# Altium schematic sheet EnDat.SchDoc
size A; SheetNumber: 2; SheetTotal: 11
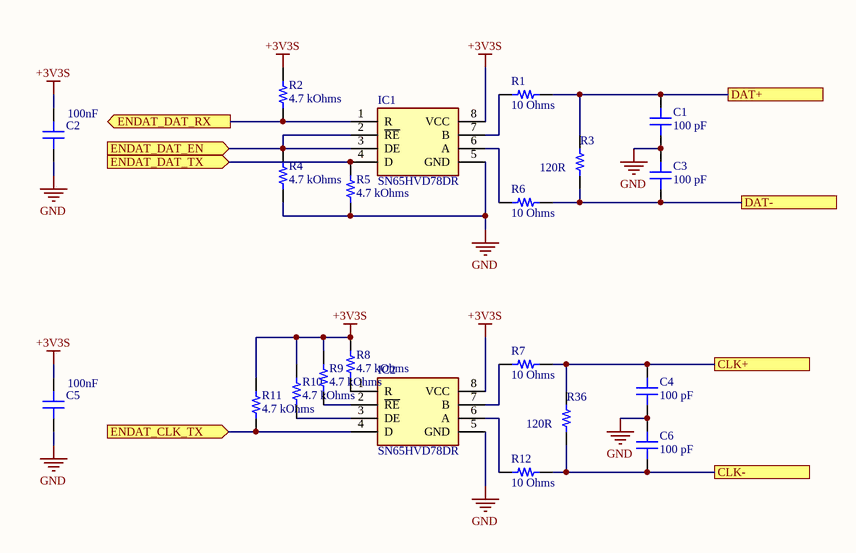
[diagram p0: EnDat.SchDoc]

## Parts
C1  100 pF  [CAP 0402_1005]
C2  100nF  [CAP 0402_1005]
C3  100 pF  [CAP 0402_1005]
C4  100 pF  [CAP 0402_1005]
C5  100nF  [CAP 0402_1005]
C6  100 pF  [CAP 0402_1005]
IC1  SN65HVD78DR  [SOIC127P600X175-8N]
IC2  SN65HVD78DR  [SOIC127P600X175-8N]
R1  10 Ohms  [RES 0402_1005]
R2  4.7 kOhms  [RES 0402_1005]
R3  120R  [RES 0603_1608]
R4  4.7 kOhms  [RES 0402_1005]
R5  4.7 kOhms  [RES 0402_1005]
R6  10 Ohms  [RES 0402_1005]
R7  10 Ohms  [RES 0402_1005]
R8  4.7 kOhms  [RES 0402_1005]
R9  4.7 kOhms  [RES 0402_1005]
R10  4.7 kOhms  [RES 0402_1005]
R11  4.7 kOhms  [RES 0402_1005]
R12  10 Ohms  [RES 0402_1005]
R36  120R  [RES 0603_1608]

## Ports
CLK+, CLK-, DAT+, DAT-, ENDAT_CLK_TX (in), ENDAT_DAT_EN (in), ENDAT_DAT_RX (out), ENDAT_DAT_TX (in)

## Nets
+3V3S: C2.2 C5.2 IC1.8(VCC) IC2.8(VCC) R2.2 R8.2 R9.2 R10.2 R11.2
GND: C1.1 C2.1 C3.2 C4.1 C5.1 C6.2 IC1.5(GND) IC2.5(GND) R4.1 R5.1
CLK+: C4.2 R7.2 R36.2 ; port CLK+
CLK-: C6.1 R12.2 R36.1 ; port CLK-
DAT+: C1.2 R1.2 R3.2 ; port DAT+
DAT-: C3.1 R3.1 R6.2 ; port DAT-
ENDAT_CLK_TX: IC2.4(D) R11.1 ; port ENDAT_CLK_TX
ENDAT_DAT_EN: IC1.2(~{RE}) IC1.3(DE) R4.2 ; port ENDAT_DAT_EN
ENDAT_DAT_RX: IC1.1(R) R2.1 ; port ENDAT_DAT_RX
ENDAT_DAT_TX: IC1.4(D) R5.2 ; port ENDAT_DAT_TX
NetIC1_6: IC1.6(A) R6.1
NetIC1_7: IC1.7(B) R1.1
NetIC2_1: IC2.1(R) R8.1
NetIC2_2: IC2.2(~{RE}) R9.1
NetIC2_3: IC2.3(DE) R10.1
NetIC2_6: IC2.6(A) R12.1
NetIC2_7: IC2.7(B) R7.1

## Library data of the parts
C1 C3 C4 C6 = 500X07N101MV4T: CAP CER 100PF 50V C0G/NP0 0402; manufacturer: Johanson Dielectrics Inc.; Temperature Coefficient: C0G, NP0; Tolerance: ±20%; Part Number: 500X07N101MV4T; Capacitance: 100 pF; Applications: Bypass, Decoupling; componentlink1description: Datasheet; componentlink1url: https://www.johansondielectrics.com/downloads/x2y-filter-and-decoupling-capacitors.pdf; componentlink2description: DigiKey Link; componentlink2url: https://www.digikey.com/en/products/detail/johanson-dielectrics-inc/500X07N101MV4T/2046917; Device Package: 0402 (1005 Metric); Features: Low ESL (X2Y); lastupdated: 2/9/2024 8:04:38 PM; Lifecycle Status: Active; Minimum Order: 1; Mounting Type: Surface Mount, MLCC; Operating Temperature: -55°C ~ 125°C; Package / Case: 0402 (1005 Metric); packaging: TapeAndReel; partid: 1767; Part Status: Active; price: 0.08; series: X2Y®; Size / Dimension: 0.045" L x 0.025" W (1.14mm x 0.64mm); Supplier 1: DigiKey; Supplier Part Number 1: 709-1214-1-ND; Thickness (Max): 0.020" (0.51mm); value: 100 pF; Voltage - Rated: 50V
C2 C5 = CL05A105KO5NNNC: CAP CER 1UF 16V X5R 0402; Part Number: C29266; manufacturer: Samsung Electro-Mechanics; Capacitance: 10uF; Tolerance: ±10%; value: 1 µF; Applications: General Purpose; componentlink1description: Datasheet; componentlink1url: http://www.samsungsem.com/kr/support/product-search/mlcc/CL05A105KO5NNNC.jsp; componentlink2description: DigiKey Link; componentlink2url: https://www.digikey.com/en/products/detail/samsung-electro-mechanics/CL05A105KO5NNNC/3886725; Device Package: 0402 (1005 Metric); lastupdated: 2/9/2024 8:04:35 PM; Lifecycle Status: Active; Minimum Order: 1; Mounting Type: Surface Mount, MLCC; Operating Temperature: -55°C ~ 85°C; Package / Case: 0402 (1005 Metric); packaging: TapeAndReel; partid: 3120; Part Status: Active; price: 0.01; series: CL; Size / Dimension: 0.039" L x 0.020" W (1.00mm x 0.50mm); Supplier 1: DigiKey; Supplier Part Number 1: 1276-1067-1-ND; Temperature Coefficient: X5R; Thickness (Max): 0.022" (0.55mm); Voltage - Rated: 16V
IC1 IC2 = SN65HVD78DR: Integrated Circuit; Manufacturer_Name: Texas Instruments; Datasheet Link: http://www.ti.com/lit/gpn/sn65hvd78; Height: 1.75mm; Manufacturer_Part_Number: SN65HVD78DR; Mouser Part Number: 595-SN65HVD78DR; Mouser Price/Stock: https://www.mouser.co.uk/ProductDetail/Texas-Instruments/SN65HVD78DR?qs=GIZt7gVh5wSQImLM3RD5ag%3D%3D; Arrow Part Number: SN65HVD78DR; Arrow Price/Stock: https://www.arrow.com/en/products/sn65hvd78dr/texas-instruments?region=nac
R1 R6 R7 R12 = WR04X100 JTL: RES 10 OHM 5% 1/16W 0402; Manufacturer: Walsin Technology Corporation; Power (Watts): 0.063W, 1/16W; Temperature Coefficient: -200/ +400ppm/°C; Part Number: WR04X100 JTL; Value: 10 Ohms; ComponentLink1Description: Datasheet; ComponentLink1URL: https://www.passivecomponent.com/wp-content/uploads/chipR/ASC_WR.pdf; ComponentLink2Description: DigiKey Link; ComponentLink2URL: https://www.digikey.com/en/products/detail/walsin-technology-corporation/WR04X100-JTL/13241174; Composition: Thick Film; Device Package: 0402 (1005 Metric); Height - Seated (Max): 0.016" (0.40mm); LastUpdated: 2/9/2024 8:28:55 PM; Lifecycle Status: Active; Minimum Order: 1; Number of Terminations: 2; Operating Temperature: -55°C ~ 155°C; Package / Case: 0402 (1005 Metric); Packaging: CutTape; PartId: 64776; Part Status: Active; Price: 0.01; Resistance: 10 Ohms; Series: WR; Size / Dimension: 0.039" L x 0.020" W (1.00mm x 0.50mm); Supplier 1: DigiKey; Supplier Part Number 1: 1292-WR04X100JTLCT-ND; Supplier Device Package: 0402; Tolerance: ±5%
R2 R4 R5 R8-R11 = WR04X4701FTL: RES 4.7K OHM 1% 1/16W 0402; Manufacturer: Walsin Technology Corporation; Power (Watts): 0.063W, 1/16W; Temperature Coefficient: ±100ppm/°C; Part Number: WR04X4701FTL; Value: 4.7 kOhms; ComponentLink1Description: Datasheet; ComponentLink1URL: https://www.passivecomponent.com/wp-content/uploads/chipR/ASC_WR.pdf; ComponentLink2Description: DigiKey Link; ComponentLink2URL: https://www.digikey.com/en/products/detail/walsin-technology-corporation/WR04X4701FTL/13239186; Composition: Thick Film; Device Package: 0402 (1005 Metric); Height - Seated (Max): 0.016" (0.40mm); LastUpdated: 2/9/2024 8:28:34 PM; Lifecycle Status: Active; Minimum Order: 1; Number of Terminations: 2; Operating Temperature: -55°C ~ 155°C; Package / Case: 0402 (1005 Metric); Packaging: CutTape; PartId: 77487; Part Status: Active; Price: 0.01; Resistance: 4.7 kOhms; Series: WR; Size / Dimension: 0.039" L x 0.020" W (1.00mm x 0.50mm); Supplier 1: DigiKey; Supplier Part Number 1: 1292-WR04X4701FTLCT-ND; Supplier Device Package: 0402; Tolerance: ±1%
R3 R36 = CR0603AFX-10R0EAS: RESA-AS 0603 10R 1% 100MW TC100; Manufacturer: Bourns Inc.; Value: 510R; Power (Watts): 0.1W, 1/10W; Resistance: 10 Ohms; Temperature Coefficient: ±100ppm/°C; Part Number: CR0603AFX-10R0EAS; ComponentLink1Description: Datasheet; ComponentLink1URL: //media.digikey.com/pdf/Data%20Sheets/Bourns%20PDFs/CRyyyyA-AS_Model_DS.pdf; ComponentLink2Description: DigiKey Link; ComponentLink2URL: https://www.digikey.com/en/products/detail/bourns-inc/CR0603AFX-10R0EAS/10240119; Composition: Thick Film; Device Package: 0603 (1608 Metric); Features: Anti-Sulfur, Automotive AEC-Q200, Moisture Resistant; Height - Seated (Max): 0.022" (0.55mm); LastUpdated: 2/9/2024 8:42:17 PM; Lifecycle Status: Active; Minimum Order: 1; Number of Terminations: 2; Operating Temperature: -55°C ~ 155°C; Package / Case: 0603 (1608 Metric); Packaging: TapeAndReel; PartId: 23787; Part Status: Active; Price: 0.01; Ratings: AEC-Q200; Series: CR0603A-AS; Size / Dimension: 0.063" L x 0.031" W (1.60mm x 0.80mm); Supplier 1: DigiKey; Supplier Part Number 1: CR0603AFX-10R0EASCT-ND; Supplier Device Package: 0603; Tolerance: ±1%
  R36: Type: *